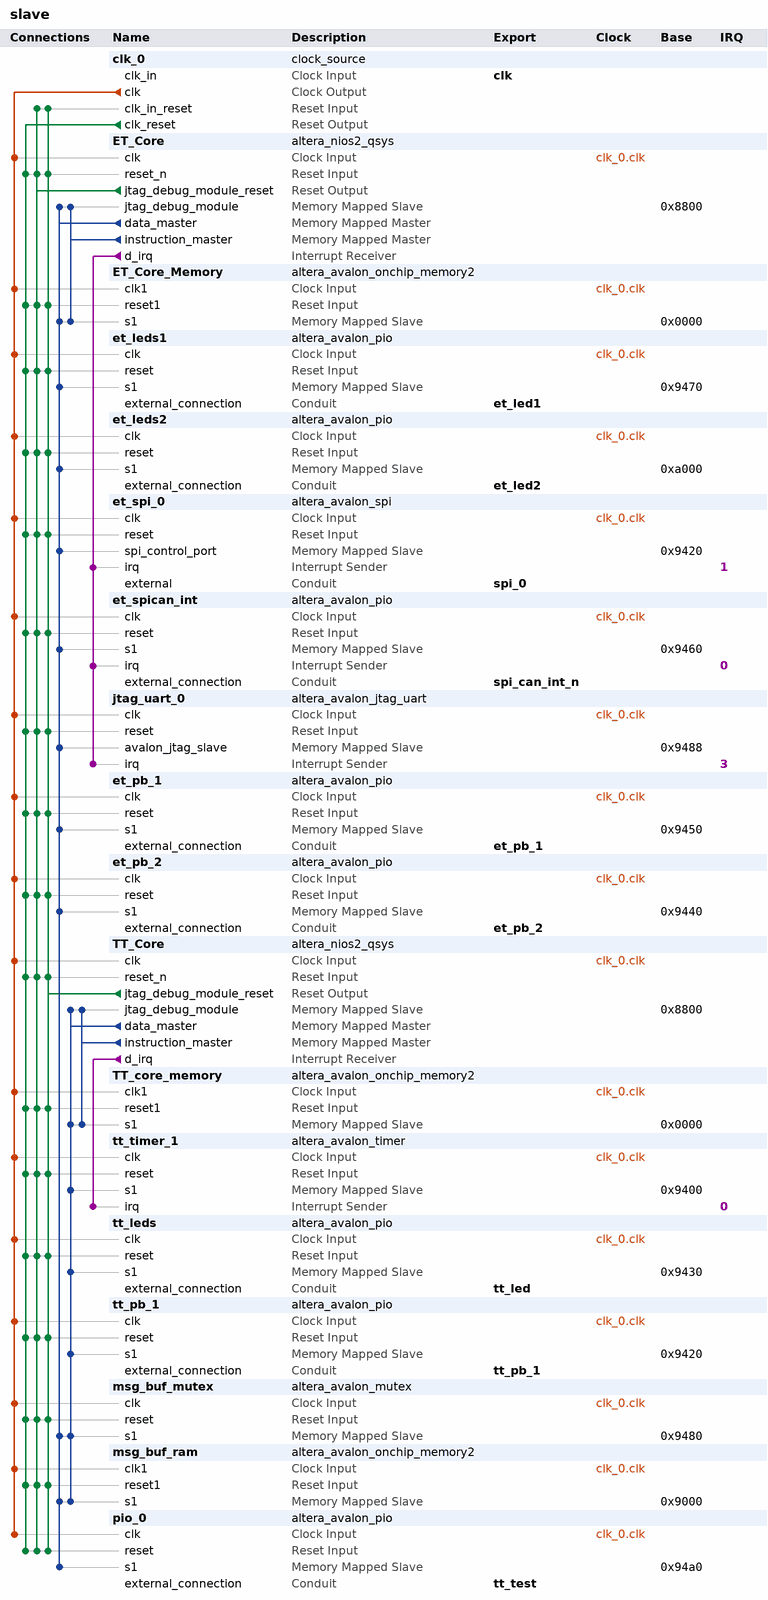
[diagram p0: system contents]
# Platform Designer (Qsys) system slave, Cyclone III EP3C16F484C6
# Parameters at their usual value, and those the tool derives, are not listed.
package require -exact qsys 13.1
create_system slave
set_project_property DEVICE_FAMILY {Cyclone III}
set_project_property DEVICE EP3C16F484C6

add_instance clk_0 clock_source 13.1
set_instance_parameter_value clk_0 clockFrequency 50000000

add_instance ET_Core altera_nios2_qsys 13.1
set_instance_parameter_value ET_Core resetSlave Absolute
set_instance_parameter_value ET_Core mmu_TLBMissExcSlave None
set_instance_parameter_value ET_Core exceptionSlave Absolute
set_instance_parameter_value ET_Core breakSlave ET_Core.jtag_debug_module
set_instance_parameter_value ET_Core impl Tiny
set_instance_parameter_value ET_Core icache_size 4096

add_instance ET_Core_Memory altera_avalon_onchip_memory2 13.1
set_instance_parameter_value ET_Core_Memory dataWidth 32
set_instance_parameter_value ET_Core_Memory dualPort false
set_instance_parameter_value ET_Core_Memory initMemContent true
set_instance_parameter_value ET_Core_Memory initializationFileName onchip_mem.hex
set_instance_parameter_value ET_Core_Memory memorySize 16348

add_instance et_leds1 altera_avalon_pio 13.1
set_instance_parameter_value et_leds1 direction Output
set_instance_parameter_value et_leds1 width 2

add_instance et_leds2 altera_avalon_pio 13.1
set_instance_parameter_value et_leds2 direction Output
set_instance_parameter_value et_leds2 width 2

add_instance et_spi_0 altera_avalon_spi 13.1
set_instance_parameter_value et_spi_0 clockPolarity 0
set_instance_parameter_value et_spi_0 dataWidth 8
set_instance_parameter_value et_spi_0 masterSPI true
set_instance_parameter_value et_spi_0 numberOfSlaves 1
set_instance_parameter_value et_spi_0 targetClockRate 128000

add_instance et_spican_int altera_avalon_pio 13.1
set_instance_parameter_value et_spican_int captureEdge true
set_instance_parameter_value et_spican_int direction Input
set_instance_parameter_value et_spican_int edgeType FALLING
set_instance_parameter_value et_spican_int generateIRQ true
set_instance_parameter_value et_spican_int irqType EDGE
set_instance_parameter_value et_spican_int simDoTestBenchWiring true
set_instance_parameter_value et_spican_int width 1

add_instance jtag_uart_0 altera_avalon_jtag_uart 13.1
set_instance_parameter_value jtag_uart_0 simInteractiveOptions NO_INTERACTIVE_WINDOWS

add_instance et_pb_1 altera_avalon_pio 13.1
set_instance_parameter_value et_pb_1 direction Input
set_instance_parameter_value et_pb_1 simDoTestBenchWiring true
set_instance_parameter_value et_pb_1 width 1

add_instance et_pb_2 altera_avalon_pio 13.1
set_instance_parameter_value et_pb_2 direction Input
set_instance_parameter_value et_pb_2 simDoTestBenchWiring true
set_instance_parameter_value et_pb_2 width 1

add_instance TT_Core altera_nios2_qsys 13.1
set_instance_parameter_value TT_Core cpuID 1
set_instance_parameter_value TT_Core resetSlave Absolute
set_instance_parameter_value TT_Core mmu_TLBMissExcSlave None
set_instance_parameter_value TT_Core exceptionSlave Absolute
set_instance_parameter_value TT_Core breakSlave TT_Core.jtag_debug_module
set_instance_parameter_value TT_Core impl Tiny
set_instance_parameter_value TT_Core icache_size 4096

add_instance TT_core_memory altera_avalon_onchip_memory2 13.1
set_instance_parameter_value TT_core_memory dataWidth 32
set_instance_parameter_value TT_core_memory dualPort false
set_instance_parameter_value TT_core_memory initMemContent true
set_instance_parameter_value TT_core_memory initializationFileName onchip_mem.hex
set_instance_parameter_value TT_core_memory memorySize 16384

add_instance tt_timer_1 altera_avalon_timer 13.1
set_instance_parameter_value tt_timer_1 period 1
set_instance_parameter_value tt_timer_1 periodUnits MSEC

add_instance tt_leds altera_avalon_pio 13.1
set_instance_parameter_value tt_leds direction Output
set_instance_parameter_value tt_leds width 4

add_instance tt_pb_1 altera_avalon_pio 13.1
set_instance_parameter_value tt_pb_1 direction Input
set_instance_parameter_value tt_pb_1 simDoTestBenchWiring true
set_instance_parameter_value tt_pb_1 width 1

add_instance msg_buf_mutex altera_avalon_mutex 13.1

add_instance msg_buf_ram altera_avalon_onchip_memory2 13.1
set_instance_parameter_value msg_buf_ram dataWidth 32
set_instance_parameter_value msg_buf_ram dualPort false
set_instance_parameter_value msg_buf_ram initMemContent true
set_instance_parameter_value msg_buf_ram initializationFileName onchip_mem.hex
set_instance_parameter_value msg_buf_ram memorySize 1024

add_instance pio_0 altera_avalon_pio 13.1
set_instance_parameter_value pio_0 direction Output
set_instance_parameter_value pio_0 width 1

# connections
add_connection clk_0.clk ET_Core.clk clock
add_connection clk_0.clk ET_Core_Memory.clk1 clock
add_connection clk_0.clk et_leds1.clk clock
add_connection clk_0.clk et_leds2.clk clock
add_connection clk_0.clk et_pb_1.clk clock
add_connection clk_0.clk et_pb_2.clk clock
add_connection clk_0.clk et_spi_0.clk clock
add_connection clk_0.clk et_spican_int.clk clock
add_connection clk_0.clk jtag_uart_0.clk clock
add_connection clk_0.clk msg_buf_mutex.clk clock
add_connection clk_0.clk msg_buf_ram.clk1 clock
add_connection clk_0.clk pio_0.clk clock
add_connection clk_0.clk TT_Core.clk clock
add_connection clk_0.clk TT_core_memory.clk1 clock
add_connection clk_0.clk tt_leds.clk clock
add_connection clk_0.clk tt_pb_1.clk clock
add_connection clk_0.clk tt_timer_1.clk clock
add_connection clk_0.clk_reset ET_Core.reset_n reset
add_connection clk_0.clk_reset ET_Core_Memory.reset1 reset
add_connection clk_0.clk_reset et_leds1.reset reset
add_connection clk_0.clk_reset et_leds2.reset reset
add_connection clk_0.clk_reset et_pb_1.reset reset
add_connection clk_0.clk_reset et_pb_2.reset reset
add_connection clk_0.clk_reset et_spi_0.reset reset
add_connection clk_0.clk_reset et_spican_int.reset reset
add_connection clk_0.clk_reset jtag_uart_0.reset reset
add_connection clk_0.clk_reset msg_buf_mutex.reset reset
add_connection clk_0.clk_reset msg_buf_ram.reset1 reset
add_connection clk_0.clk_reset pio_0.reset reset
add_connection clk_0.clk_reset TT_Core.reset_n reset
add_connection clk_0.clk_reset TT_core_memory.reset1 reset
add_connection clk_0.clk_reset tt_leds.reset reset
add_connection clk_0.clk_reset tt_pb_1.reset reset
add_connection clk_0.clk_reset tt_timer_1.reset reset
add_connection ET_Core.jtag_debug_module_reset clk_0.clk_in_reset reset
add_connection ET_Core.jtag_debug_module_reset ET_Core.reset_n reset
add_connection ET_Core.jtag_debug_module_reset ET_Core_Memory.reset1 reset
add_connection ET_Core.jtag_debug_module_reset et_leds1.reset reset
add_connection ET_Core.jtag_debug_module_reset et_leds2.reset reset
add_connection ET_Core.jtag_debug_module_reset et_pb_1.reset reset
add_connection ET_Core.jtag_debug_module_reset et_pb_2.reset reset
add_connection ET_Core.jtag_debug_module_reset et_spi_0.reset reset
add_connection ET_Core.jtag_debug_module_reset et_spican_int.reset reset
add_connection ET_Core.jtag_debug_module_reset jtag_uart_0.reset reset
add_connection ET_Core.jtag_debug_module_reset msg_buf_mutex.reset reset
add_connection ET_Core.jtag_debug_module_reset msg_buf_ram.reset1 reset
add_connection ET_Core.jtag_debug_module_reset pio_0.reset reset
add_connection ET_Core.jtag_debug_module_reset TT_Core.reset_n reset
add_connection ET_Core.jtag_debug_module_reset TT_core_memory.reset1 reset
add_connection ET_Core.jtag_debug_module_reset tt_leds.reset reset
add_connection ET_Core.jtag_debug_module_reset tt_pb_1.reset reset
add_connection ET_Core.jtag_debug_module_reset tt_timer_1.reset reset
add_connection TT_Core.jtag_debug_module_reset clk_0.clk_in_reset reset
add_connection TT_Core.jtag_debug_module_reset ET_Core.reset_n reset
add_connection TT_Core.jtag_debug_module_reset ET_Core_Memory.reset1 reset
add_connection TT_Core.jtag_debug_module_reset et_leds1.reset reset
add_connection TT_Core.jtag_debug_module_reset et_leds2.reset reset
add_connection TT_Core.jtag_debug_module_reset et_pb_1.reset reset
add_connection TT_Core.jtag_debug_module_reset et_pb_2.reset reset
add_connection TT_Core.jtag_debug_module_reset et_spi_0.reset reset
add_connection TT_Core.jtag_debug_module_reset et_spican_int.reset reset
add_connection TT_Core.jtag_debug_module_reset jtag_uart_0.reset reset
add_connection TT_Core.jtag_debug_module_reset msg_buf_mutex.reset reset
add_connection TT_Core.jtag_debug_module_reset msg_buf_ram.reset1 reset
add_connection TT_Core.jtag_debug_module_reset pio_0.reset reset
add_connection TT_Core.jtag_debug_module_reset TT_Core.reset_n reset
add_connection TT_Core.jtag_debug_module_reset TT_core_memory.reset1 reset
add_connection TT_Core.jtag_debug_module_reset tt_leds.reset reset
add_connection TT_Core.jtag_debug_module_reset tt_pb_1.reset reset
add_connection TT_Core.jtag_debug_module_reset tt_timer_1.reset reset
add_connection ET_Core.data_master ET_Core.jtag_debug_module avalon
set_connection_parameter_value ET_Core.data_master/ET_Core.jtag_debug_module baseAddress 0x8800
add_connection ET_Core.data_master ET_Core_Memory.s1 avalon
set_connection_parameter_value ET_Core.data_master/ET_Core_Memory.s1 baseAddress 0x0000
add_connection ET_Core.data_master et_leds1.s1 avalon
set_connection_parameter_value ET_Core.data_master/et_leds1.s1 baseAddress 0x9470
add_connection ET_Core.data_master et_leds2.s1 avalon
set_connection_parameter_value ET_Core.data_master/et_leds2.s1 baseAddress 0xa000
add_connection ET_Core.data_master et_pb_1.s1 avalon
set_connection_parameter_value ET_Core.data_master/et_pb_1.s1 baseAddress 0x9450
add_connection ET_Core.data_master et_pb_2.s1 avalon
set_connection_parameter_value ET_Core.data_master/et_pb_2.s1 baseAddress 0x9440
add_connection ET_Core.data_master et_spi_0.spi_control_port avalon
set_connection_parameter_value ET_Core.data_master/et_spi_0.spi_control_port baseAddress 0x9420
add_connection ET_Core.data_master et_spican_int.s1 avalon
set_connection_parameter_value ET_Core.data_master/et_spican_int.s1 baseAddress 0x9460
add_connection ET_Core.data_master jtag_uart_0.avalon_jtag_slave avalon
set_connection_parameter_value ET_Core.data_master/jtag_uart_0.avalon_jtag_slave baseAddress 0x9488
add_connection ET_Core.data_master msg_buf_mutex.s1 avalon
set_connection_parameter_value ET_Core.data_master/msg_buf_mutex.s1 baseAddress 0x9480
add_connection ET_Core.data_master msg_buf_ram.s1 avalon
set_connection_parameter_value ET_Core.data_master/msg_buf_ram.s1 baseAddress 0x9000
add_connection ET_Core.data_master pio_0.s1 avalon
set_connection_parameter_value ET_Core.data_master/pio_0.s1 baseAddress 0x94a0
add_connection ET_Core.instruction_master ET_Core.jtag_debug_module avalon
set_connection_parameter_value ET_Core.instruction_master/ET_Core.jtag_debug_module baseAddress 0x8800
add_connection ET_Core.instruction_master ET_Core_Memory.s1 avalon
set_connection_parameter_value ET_Core.instruction_master/ET_Core_Memory.s1 baseAddress 0x0000
add_connection TT_Core.data_master msg_buf_mutex.s1 avalon
set_connection_parameter_value TT_Core.data_master/msg_buf_mutex.s1 baseAddress 0x9480
add_connection TT_Core.data_master msg_buf_ram.s1 avalon
set_connection_parameter_value TT_Core.data_master/msg_buf_ram.s1 baseAddress 0x9000
add_connection TT_Core.data_master TT_Core.jtag_debug_module avalon
set_connection_parameter_value TT_Core.data_master/TT_Core.jtag_debug_module baseAddress 0x8800
add_connection TT_Core.data_master TT_core_memory.s1 avalon
set_connection_parameter_value TT_Core.data_master/TT_core_memory.s1 baseAddress 0x0000
add_connection TT_Core.data_master tt_leds.s1 avalon
set_connection_parameter_value TT_Core.data_master/tt_leds.s1 baseAddress 0x9430
add_connection TT_Core.data_master tt_pb_1.s1 avalon
set_connection_parameter_value TT_Core.data_master/tt_pb_1.s1 baseAddress 0x9420
add_connection TT_Core.data_master tt_timer_1.s1 avalon
set_connection_parameter_value TT_Core.data_master/tt_timer_1.s1 baseAddress 0x9400
add_connection TT_Core.instruction_master TT_Core.jtag_debug_module avalon
set_connection_parameter_value TT_Core.instruction_master/TT_Core.jtag_debug_module baseAddress 0x8800
add_connection TT_Core.instruction_master TT_core_memory.s1 avalon
set_connection_parameter_value TT_Core.instruction_master/TT_core_memory.s1 baseAddress 0x0000
add_connection ET_Core.d_irq et_spi_0.irq interrupt
set_connection_parameter_value ET_Core.d_irq/et_spi_0.irq irqNumber 1
add_connection ET_Core.d_irq et_spican_int.irq interrupt
set_connection_parameter_value ET_Core.d_irq/et_spican_int.irq irqNumber 0
add_connection ET_Core.d_irq jtag_uart_0.irq interrupt
set_connection_parameter_value ET_Core.d_irq/jtag_uart_0.irq irqNumber 3
add_connection TT_Core.d_irq tt_timer_1.irq interrupt
set_connection_parameter_value TT_Core.d_irq/tt_timer_1.irq irqNumber 0

# exported interfaces
add_interface clk clock sink
set_interface_property clk EXPORT_OF clk_0.clk_in
add_interface et_led1 conduit end
set_interface_property et_led1 EXPORT_OF et_leds1.external_connection
add_interface et_led2 conduit end
set_interface_property et_led2 EXPORT_OF et_leds2.external_connection
add_interface spi_0 conduit end
set_interface_property spi_0 EXPORT_OF et_spi_0.external
add_interface spi_can_int_n conduit end
set_interface_property spi_can_int_n EXPORT_OF et_spican_int.external_connection
add_interface et_pb_1 conduit end
set_interface_property et_pb_1 EXPORT_OF et_pb_1.external_connection
add_interface et_pb_2 conduit end
set_interface_property et_pb_2 EXPORT_OF et_pb_2.external_connection
add_interface tt_led conduit end
set_interface_property tt_led EXPORT_OF tt_leds.external_connection
add_interface tt_pb_1 conduit end
set_interface_property tt_pb_1 EXPORT_OF tt_pb_1.external_connection
add_interface tt_test conduit end
set_interface_property tt_test EXPORT_OF pio_0.external_connection

set_interconnect_requirement {$system} qsys_mm.clockCrossingAdapter HANDSHAKE
set_interconnect_requirement {$system} qsys_mm.maxAdditionalLatency 1
set_interconnect_requirement {$system} qsys_mm.insertDefaultSlave false

save_system slave.qsys
